# EAGLE design Zio Qwiic RGB Color Sensor TCS34725 (EAGLE 9.1.1)
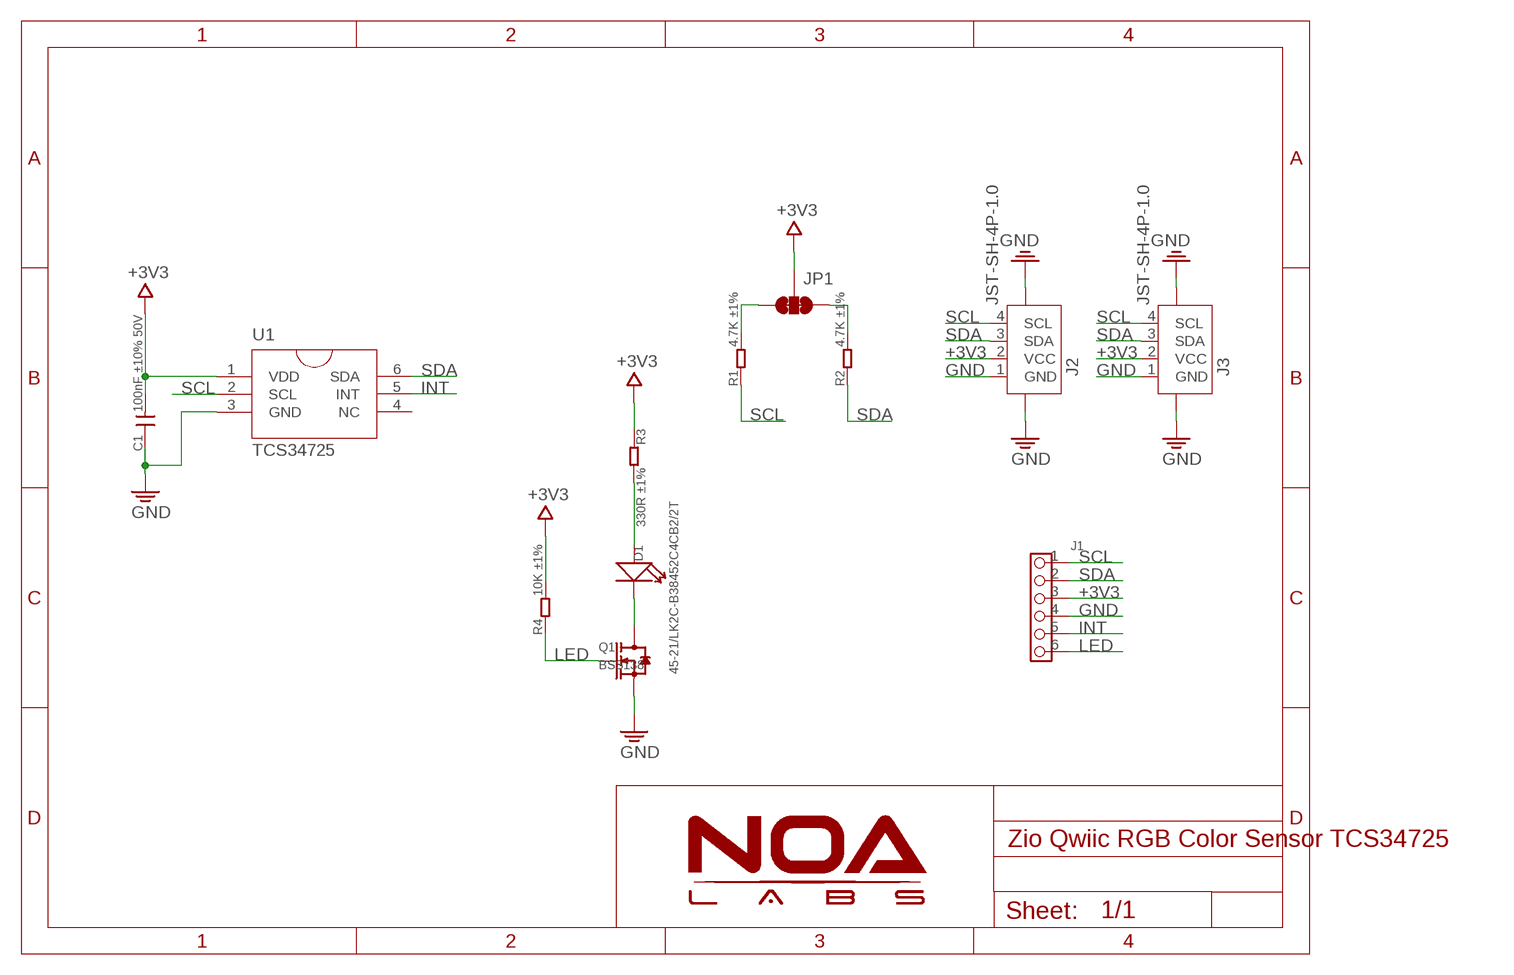
[diagram p0: schematic, sheet 1]

## Parts
C1  100nF ±10% 50V  C-0603  [C0603]
D1  45-21/LK2C-B38452C4CB2/2T  LED3020  [EVERLIGHT_45-21]
J1  HEADER-6P-60/35MIL  [6P-2.54-60/35MIL]
J2  JST-SH-4P-1.0  [JST-SH-4P]
J3  JST-SH-4P-1.0  [JST-SH-4P]
JP1  SMT-JUMPER_3_2-NC_TRACE  [SMT-JUMPER_3_2-NC_TRACE]
Q1  BSS138  MOSFET-N-SOT23  [SOT23]
R1  4.7K ±1%  R-0603  [R0603]
R2  4.7K ±1%  R-0603  [R0603]
R3  330R ±1%  R-0603  [R0603]
R4  10K ±1%  R-0603  [R0603]
U1  TCS34725  [FN6_TCS3472]

## Nets
+3V3: C1.2 J1.3 J2.2(VCC) J3.2(VCC) JP1.2 R3.1 R4.2 U1.1(VDD)
GND: C1.1 J1.4 J2.1(GND) J2.NC1 J2.NC2 J3.1(GND) J3.NC1 J3.NC2 Q1.2(S) U1.3(GND)
INT: J1.5 U1.5(INT)
LED: J1.6 Q1.1(G) R4.1
N$1: D1.A(+) R3.2
N$2: D1.K(-) Q1.3(D)
N$6: JP1.3 R1.2
N$8: JP1.1 R2.2
SCL: J1.1 J2.4(SCL) J3.4(SCL) R1.1 U1.2(SCL)
SDA: J1.2 J2.3(SDA) J3.3(SDA) R2.1 U1.6(SDA)
Unconnected: U1.4(NC)

## Library data of the parts
C1 = RCL:C
D1 = Discretex:LED*
J1 = Connector_NOA:HEADER-6P
J2 J3 = Connector:JST-SH-4P
JP1 = NOA-Jumpers:SMT-JUMPER_3_2-NC_TRACE
Q1 = Discretex:MOSFET-N
R1-R4 = RCL:R
U1 = IC:TCS34725

## Board
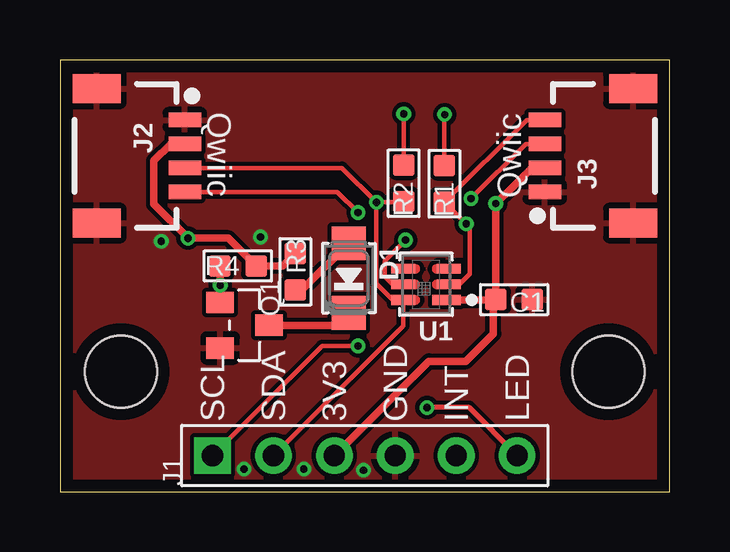
[diagram p1: board, top side]
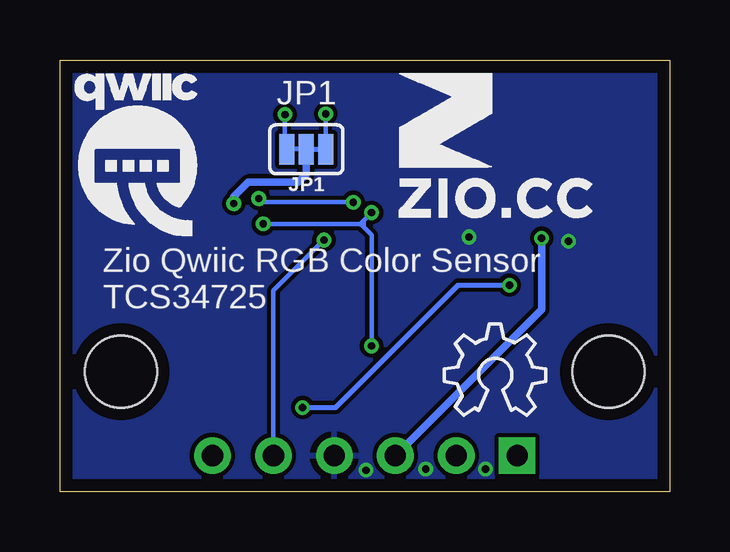
[diagram p2: board, bottom side, seen from below]

Size 25.4 x 18 mm. Coordinates in mm from the lower left corner, seen from the top.
Outline: 0,0 25.4,0 25.4,18 0,18 0,0
Copper layers (1*16): Top 0.035mm / dielectric 1.5mm / Bottom 0.035mm
Design rules "NOA Eagle Rule": minimum track width 7mil, minimum drill 12mil, track to track 7mil, track to pad 7mil, pad to pad 7mil, via to via 7mil, smd to smd 0mil, copper to edge 20mil, drill to drill 10mil, minimum pad ring 10mil, minimum via ring 6mil, stop-mask expansion 2mil, vias tented up to drill 25mil, thermal gap 10mil
Holes 3 mm at 2.54,5 22.86,5

### Footprints (pad centres in the part's own frame; a part is rotated, then mirrored left to right if it is on the bottom)
C0603 = smd 0.889 x 0.889: 1 -0.762,0; 2 0.762,0
EVERLIGHT_45-21 = smd 1.4 x 1.4: A -1.45,0; K 1.45,0
6P-2.54-60/35MIL = drill 0.889 pad 1.524 square: 1 0,6.35 | drill 0.889 pad 1.524: 2 0,3.81; 3 0,1.27; 4 0,-1.27; 5 0,-3.81; 6 0,-6.35
JST-SH-4P = smd 0.6 x 1.35: 1 1.5,0; 2 0.5,0; 3 -0.5,0; 4 -1.5,0 | smd 1.2 x 2: NC1 -2.8,3.675; NC2 2.8,3.675
SMT-JUMPER_3_2-NC_TRACE = smd 0.635 x 1.27: 1 -0.813,0; 2 0,0; 3 0.813,0
SOT23 = smd 0.889 x 1.143: 1 -0.95,-1.016; 2 0.95,-1.016; 3 0,1.016
R0603 = smd 0.889 x 0.889: 1 -0.762,0; 2 0.762,0
FN6_TCS3472 = smd 1.2 x 0.4: 1 -0.85,0.65 | smd 1 x 0.4: 2 -0.95,0; 3 -0.95,-0.65; 4 0.95,-0.65; 5 0.95,0; 6 0.95,0.65

### Placement (x,y rotation side)
C1  18.92,8.01 180 top
D1  12.03,8.9 270 top
J1  12.7,1.5 90 top
J2  5.2,14 90 top
J3  20.2,14 270 top
JP1  15.14,14.28 180 bottom
Q1  7.69,6.94 270 top
R1  16.02,12.84 90 top
R2  14.32,12.86 90 top
R3  9.81,9.16 270 top
R4  7.42,9.41 0 top
U1  15.25,8.64 180 top
U$5  [6MM]  11.3,11.43 0 bottom
U$6  [OSHW_6X150_NOTEXT]  9.4,3.17 0 bottom
U$7  [QWIIC-LOGO-MEDIUM]  22.23,14.1 0 bottom

### Tracks (layer width: path | path; a pad name or v marks a point on that pad's centre or on a via)
+3V3  (via drill 0.3)
  Top 0.305: J3.2 19.65,13.5 18.83,12.69 v18.16,12.01 C1.2 | J2.2 4.62,14.5 3.91,13.79 3.91,11.99 v5.33,10.57 7.02,10.57 R4.2 9.29,9.41 R3.1 | C1.2 18.1,8.01 | J1.3 15.37,5.44 16.92,5.44 18.06,6.58 18.06,7.91 C1.2 | U1.1 18.14,7.99 C1.2
  Bottom 0.305: J1.3 5.33,7.6 v5.33,10.57 | v18.16,12.01 18.16,12.3 17.55,12.9 15.47,12.9 15.13,13.24 JP1.2
GND  (via drill 0.3)
  other vias: 10.16,0.94 7.67,0.94 12.65,0.89 8.36,10.62 4.22,10.44
  pour Bottom: 0,18.01 25.4,18.01 25.4,0 0,0
  pour Top: 0,18.01 25.4,18.01 25.4,0 0,0
INT  (via drill 0.3)
  Top 0.178: v14.4,10.49 13.53,9.62 13.53,8.98 13.87,8.64 U1.5
  Bottom 0.178: v14.4,10.49 16.51,8.38 J1.5
LED  (via drill 0.3)
  Top 0.203: J1.6 17.05,3.5 v15.29,3.5
  Top 0.305: Q1.1 v6.67,8.61 6.67,9.38 R4.1
  Bottom 0.203: v15.29,3.5 13.92,3.5 8.81,8.61 v6.67,8.61
N$1
  Top 0.305: D1.A 10.08,8.4 R3.2
N$2
  Top 0.305: Q1.3 11.52,6.94 D1.K
N$6  (via drill 0.3)
  Top 0.178: R1.2 16.02,15.71 v16.03,15.72
  Bottom 0.178: JP1.3 16.03,14.36 v16.03,15.72
N$8  (via drill 0.3)
  Top 0.178: R2.2 14.31,15.74 v14.33,15.75
  Bottom 0.178: JP1.1 v14.33,15.75
SCL  (via drill 0.3)
  Top 0.178: J3.4 19.44,15.5 R1.1 v16.93,11.16 17.07,11.02 17.07,9.08 16.63,8.64 U1.2 | J2.4 11.55,12.5 v12.42,11.63 | J1.1 10.92,6.07 v12.42,6.07
  Bottom 0.178: v12.42,11.63 12.76,11.29 | 12.76,11.29 12.89,11.16 | 12.89,11.16 v16.93,11.16 | v12.42,6.07 12.42,10.69 12.75,11.02 | 12.75,11.02 12.89,11.16 | 12.75,11.02 12.75,11.28 12.76,11.29
SDA  (via drill 0.3)
  Top 0.178: J3.3 19.4,14.5 v17.12,12.22 | v13.18,12.06 14.28,12.06 R2.1 | v13.18,12.06 13.18,9.77 13.18,8.68 13.87,7.99 U1.6 14.3,6.91 J1.2 | J2.3 11.75,13.5 v13.18,12.06
  Bottom 0.178: v17.12,12.22 16.97,12.06 v13.18,12.06

### Text on the board
tPlace: Qwiic | Qwiic | SCL | SDA | 3V3 | GND | INT | LED
bPlace: JP1 | Zio Qwiic RGB Color Sensor / TCS34725